# EAGLE design MUS-1099 (EAGLE 9.5.2)
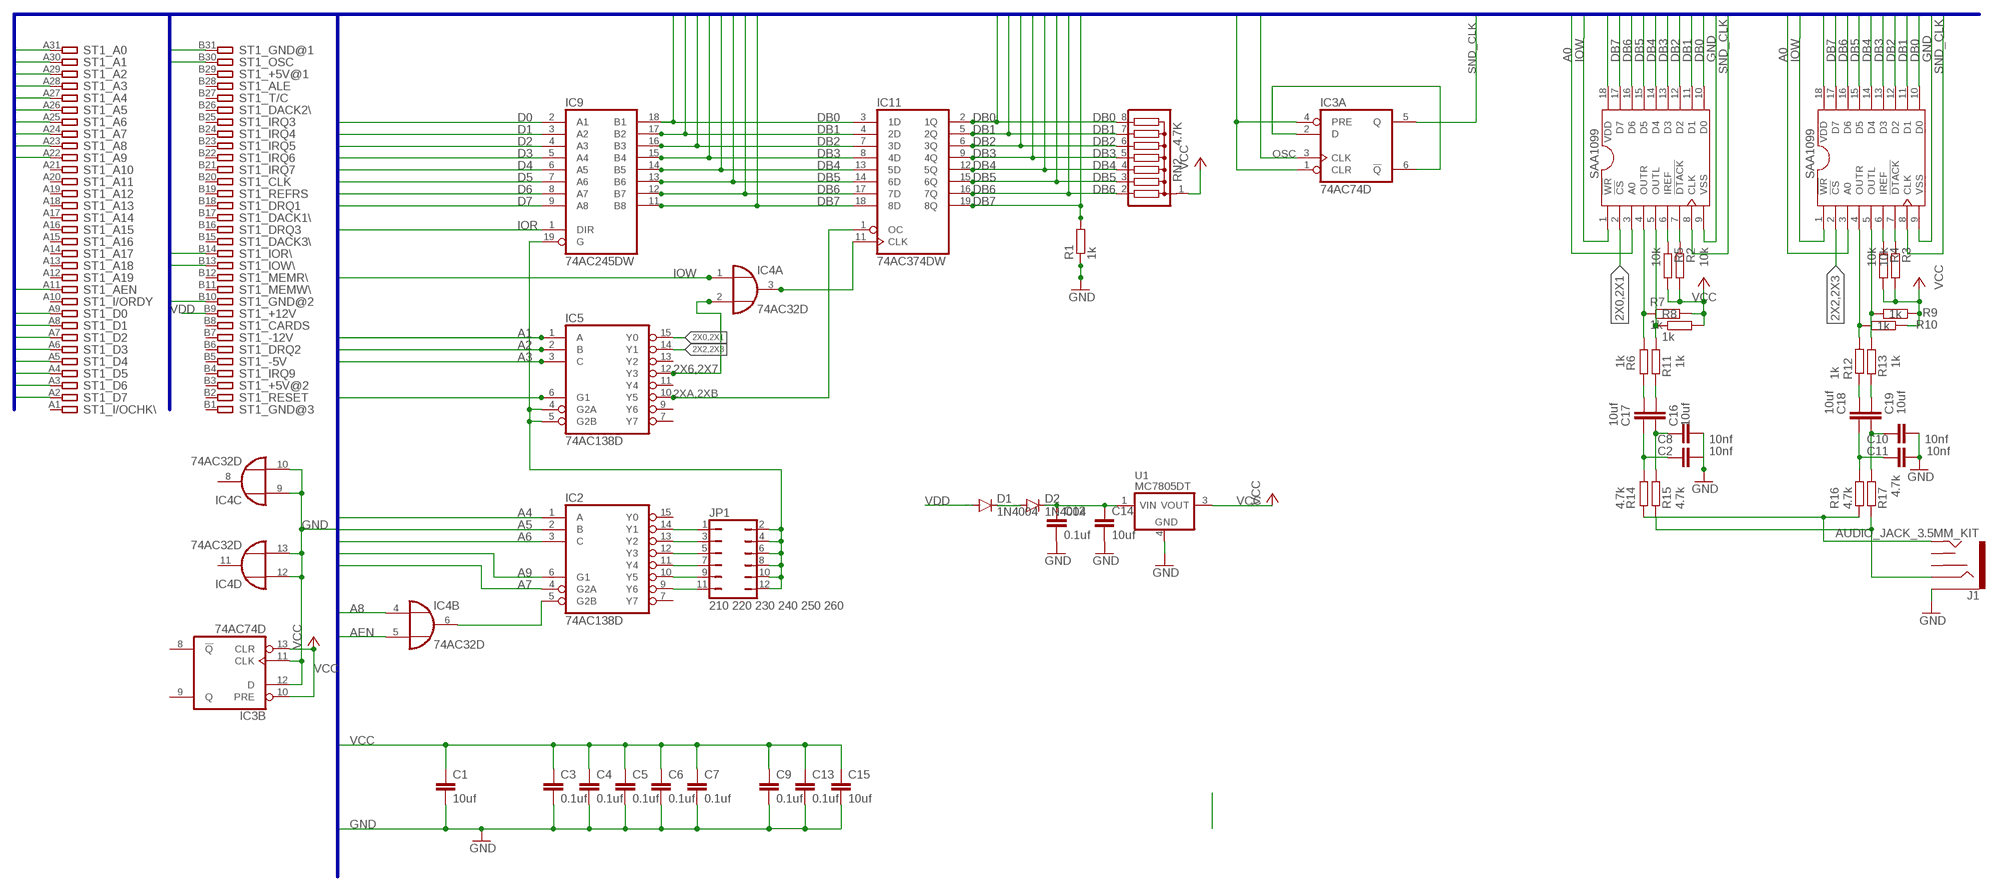
[diagram p0: schematic, sheet 1]

## Parts
C1  10uf  C-EUC0805  [C0805]
C2  10nf  C-EUC0805K  [C0805K]
C3  0.1uf  C-EUC0805  [C0805]
C4  0.1uf  C-EUC0805  [C0805]
C5  0.1uf  C-EUC0805  [C0805]
C6  0.1uf  C-EUC0805  [C0805]
C7  0.1uf  C-EUC0805  [C0805]
C8  10nf  C-EUC0805K  [C0805K]
C9  0.1uf  C-EUC0805  [C0805]
C10  10nf  C-EUC0805K  [C0805K]
C11  10nf  C-EUC0805K  [C0805K]
C12  0.1uf  C-EUC0805  [C0805]
C13  0.1uf  C-EUC0805  [C0805]
C14  10uf  C-EUC0805K  [C0805K]
C15  10uf  C-EUC0805K  [C0805K]
C16  10uf  C-EUC0805K  [C0805K]
C17  10uf  C-EUC0805K  [C0805K]
C18  10uf  C-EUC0805K  [C0805K]
C19  10uf  C-EUC0805K  [C0805K]
D1  1N4004  [DO41-10]
D2  1N4004  [DO41-10]
IC2  74AC138D  [SO16]
IC3  74AC74D  [SO14]
IC4  74AC32D  [SO14]
IC5  74AC138D  [SO16]
IC7  SAA1099  [DIL18]
IC8  SAA1099  [DIL18]
IC9  74AC245DW  [SO20W]
IC11  74AC374DW  [SO20W]
J1  AUDIO_JACK_3.5MM_KIT  [AUDIO-JACK-KIT]
JP1  210 220 230 240 250 260  JP6Q  [JP6Q]
R1  1k  R-EU_R0805  [R0805]
R2  10k  R-EU_R0805  [R0805]
R3  10k  R-EU_R0805  [R0805]
R4  10k  R-EU_R0805  [R0805]
R5  10k  R-EU_R0805  [R0805]
R6  1k  R-EU_R0805  [R0805]
R7  1k  R-EU_R0805  [R0805]
R8  1k  R-EU_R0805  [R0805]
R9  1k  R-EU_R0805  [R0805]
R10  1k  R-EU_R0805  [R0805]
R11  1k  R-EU_R0805  [R0805]
R12  1k  R-EU_R0805  [R0805]
R13  1k  R-EU_R0805  [R0805]
R14  4.7k  R-EU_R0805  [R0805]
R15  4.7k  R-EU_R0805  [R0805]
R16  4.7k  R-EU_R0805  [R0805]
R17  4.7k  R-EU_R0805  [R0805]
RN2  4.7K  G07R  [SIL8]
ST1  8 bit ISA  IBM8BIT  [IBM8BIT]
U1  MC7805DT  [DPAK-3]

## Nets
2X0,2X1: IC5.15(Y0) IC7.2(!CS!)
2X2,2X3: IC5.14(Y1) IC8.2(!CS!)
2X6,2X7: IC4.2(A:I1) IC5.12(Y3)
2XA,2XB: IC5.10(Y5) IC11.1(OC)
A0: IC7.3(A0) IC8.3(A0) ST1.A31
A1: IC5.1(A) ST1.A30
A2: IC5.2(B) ST1.A29
A3: IC5.3(C) ST1.A28
A4: IC2.1(A) ST1.A27
A5: IC2.2(B) ST1.A26
A6: IC2.3(C) ST1.A25
A7: IC2.4(G2A) ST1.A24
A8: IC4.4(B:I0) ST1.A23
A9: IC2.6(G1) ST1.A22
AEN: IC4.5(B:I1) ST1.A11
D0: IC9.2(A1) ST1.A9
D1: IC9.3(A2) ST1.A8
D2: IC9.4(A3) ST1.A7
D3: IC9.5(A4) ST1.A6
D4: IC9.6(A5) ST1.A5
D5: IC9.7(A6) ST1.A4
D6: IC9.8(A7) ST1.A3
D7: IC9.9(A8) ST1.A2
DB0: IC7.10(D0) IC8.10(D0) IC9.18(B1) IC11.2(1Q) IC11.3(1D) RN2.8
DB1: IC7.11(D1) IC8.11(D1) IC9.17(B2) IC11.4(2D) IC11.5(2Q) RN2.7
DB2: IC7.12(D2) IC8.12(D2) IC9.16(B3) IC11.6(3Q) IC11.7(3D) RN2.6
DB3: IC7.13(D3) IC8.13(D3) IC9.15(B4) IC11.8(4D) IC11.9(4Q) RN2.5
DB4: IC7.14(D4) IC8.14(D4) IC9.14(B5) IC11.12(5Q) IC11.13(5D) RN2.4
DB5: IC7.15(D5) IC8.15(D5) IC9.13(B6) IC11.14(6D) IC11.15(6Q) RN2.3
DB6: IC7.16(D6) IC8.16(D6) IC9.12(B7) IC11.16(7Q) IC11.17(7D) RN2.2
DB7: IC7.17(D7) IC8.17(D7) IC9.11(B8) IC11.18(8D) IC11.19(8Q) R1.2
GND: C1.2 C2.2 C3.2 C4.2 C5.2 C6.2 C7.2 C8.2 C9.2 C10.2 C11.2 C12.2 C13.2 C14.2 C15.2 IC3.11(B:CLK) IC3.12(B:D) IC4.9(C:I0) IC4.10(C:I1) IC4.12(D:I0) IC4.13(D:I1) IC7.9(VSS) IC8.9(VSS) J1.SLEEVE R1.1 ST1.B10 ST1.B31 U1.4(GND)
IOR: IC9.1(DIR) ST1.B14
IOW: IC4.1(A:I0) IC7.1(!WR!) IC8.1(!WR!) ST1.B13
N210: IC2.14(Y1) JP1.1
N220: IC2.13(Y2) JP1.3
N230: IC2.12(Y3) JP1.5
N240: IC2.11(Y4) JP1.7
N250: IC2.10(Y5) JP1.9
N260: IC2.9(Y6) JP1.11
N$1: IC2.5(G2B) IC4.6(B:O)
N$3: IC7.6(IREF) R5.1
N$4: IC7.7(!DTACK!) R2.1
N$5: IC8.7(!DTACK!) R3.1
N$6: IC8.6(IREF) R4.1
N$7: IC7.4(OUTR) R6.1 R7.1
N$8: IC5.4(G2A) IC5.5(G2B) IC9.19(G) JP1.2 JP1.4 JP1.6 JP1.8 JP1.10 JP1.12
N$9: IC7.5(OUTL) R8.1 R11.1
N$10: IC4.3(A:O) IC11.11(CLK)
N$11: IC3.2(A:D) IC3.6(A:!Q)
N$12: IC8.4(OUTR) R10.2 R12.2
N$13: IC8.5(OUTL) R9.2 R13.1
N$14: C2.1 C17.2 R14.1
N$15: C8.1 C16.2 R15.1
N$16: C11.1 C18.2 R16.1
N$17: C10.1 C19.2 R17.1
N$18: J1.RING R15.2 R17.2
N$19: J1.TIP R14.2 R16.2
N$20: D1.C D2.A
N$21: C12.1 C14.1 D2.C U1.1(VIN)
N$22: C17.1 R6.2
N$23: C16.1 R11.2
N$24: C18.1 R12.1
N$25: C19.1 R13.2
OSC: IC3.3(A:CLK) ST1.B30
SND_CLK: IC3.5(A:Q) IC7.8(CLK) IC8.8(CLK)
VCC: C1.1 C3.1 C4.1 C5.1 C6.1 C7.1 C9.1 C13.1 C15.1 IC3.1(A:CLR) IC3.4(A:PRE) IC3.10(B:PRE) IC3.13(B:CLR) IC5.6(G1) IC7.18(VDD) IC8.18(VDD) R2.2 R3.2 R4.2 R5.2 R7.2 R8.2 R9.1 R10.1 RN2.1 U1.3(VOUT)
VDD: D1.A ST1.B9
Unconnected: IC2.7(Y7) IC2.15(Y0) IC3.8(B:!Q) IC3.9(B:Q) IC4.8(C:O) IC4.11(D:O) IC5.7(Y7) IC5.9(Y6) IC5.11(Y4) IC5.13(Y2) J1.RSH J1.TSH ST1.A1 ST1.A10 ST1.A12 ST1.A13 ST1.A14 ST1.A15 ST1.A16 ST1.A17 ST1.A18 ST1.A19 ST1.A20 ST1.A21 ST1.B1 ST1.B2 ST1.B3 ST1.B4 ST1.B5 ST1.B6 ST1.B7 ST1.B8 ST1.B11 ST1.B12 ST1.B15 ST1.B16 ST1.B17 ST1.B18 ST1.B19 ST1.B20 ST1.B21 ST1.B22 ST1.B23 ST1.B24 ST1.B25 ST1.B26 ST1.B27 ST1.B28 ST1.B29

## Buses
A[0..9],AEN,D[0..7],DB[0..7],GND,IOR,IOW,OSC,SND_CLK,VCC

## Power pins joined to a net without a drawn wire
GND: IC2.8(GND) IC3.7(P:GND) IC4.7(P:GND) IC5.8(GND) IC9.10(GND) IC11.10(GND)
VCC: IC2.16(VCC) IC3.14(P:VCC) IC4.14(P:VCC) IC5.16(VCC) IC9.20(VCC) IC11.20(VCC)

## Library data of the parts
C1-C19 = rcl:C-EU: CAPACITOR, European symbol; SPICEPREFIX: C
D1 D2 = diode:1N4004: DIODE general purpose rectifier, 1 A
IC2 IC5 = 74xx-eu:74*138: 3-line to 8-line DECODER/DEMULTIPLEXER
IC3 = 74xx-eu:74*74: Dual D type positive edge triggered FLIP FLOP, preset and clear
IC4 = 74xx-eu:74*32: Quad 2-input OR gate
IC7 IC8 = William-Custom:SAA1099
IC9 = 74xx-eu:74*245: Octal BUS TRANSCEIVER, 3-state
IC11 = 74xx-eu:74*374: Octal D type transparent LATCH, edge triggered
J1 = SparkFun-Connectors:AUDIO_JACK_3.5MM: Audio Jack 3.5mm variants of PTH and SMT stereo audio jack with bypass switches. SparkFun Products: SparkFun SparkPunk Sound Kit <[https://www.sparkfun.com/products/11177]> - PTH MP3 Trigger <https://www.sparkfun.com/products/13720> -3.5mm SMD SparkFun PicoBoard <https://www.sparkfun.com/products/11888>- 2.5mm SMD; PROD_ID: CONN-08774; SF_ID: PRT-08032
JP1 = William-Custom:JP6Q: JUMPER
R1-R17 = rcl:R-EU_: RESISTOR, European symbol; SPICEPREFIX: R
RN2 = resistor-sil:G07R: SIL RESISTOR; OC_FARNELL: unknown; OC_NEWARK: unknown
ST1 = William-Custom:IBM8BIT: 8-bit CARD IBM/PC-AT
U1 = _hhn_78xx_79xx_NCV78xx_d2pak_dpak:MC78*: 78xx SMD (D2PAK, DPAK) (MC)78xx..DT (DPAK-3; Rth,JA = 92 K/W) (MC)78xx..D2T (D2PAK-3; Rth,JA = 45 K/W @ 10x10mm copper area) Linear Voltage Regulators, Positive, 1 A (ON Semiconductor) Package dimenisions and soldering footprints acc. to ONSEMI specs. Source: http://onsemi.com Datasheet document#: MC7800/D Technologies: 78xxyD(2)Tz: xx = Output Voltage (V) y, z: additional suffixes see manufacturer's datasheet Author: Dipl.-Ing. FH Rainer Bayer HHN Hochschule Heilbronn, rainer.bayer@hs-heilbronn.de Ingenieurbüro ing-rb, mail@ing-rb.de

## Board
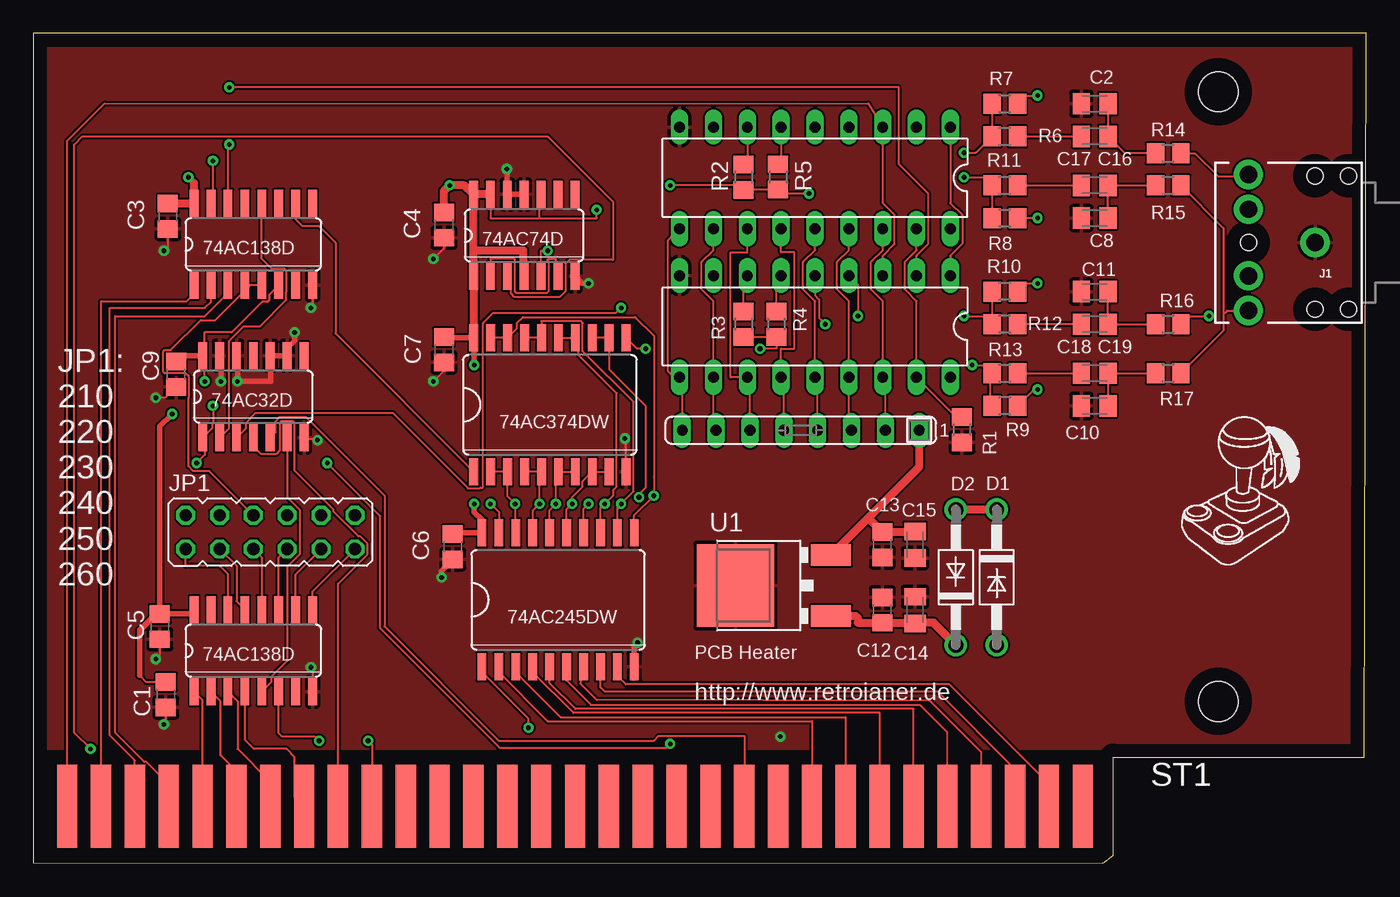
[diagram p1: board, top side]
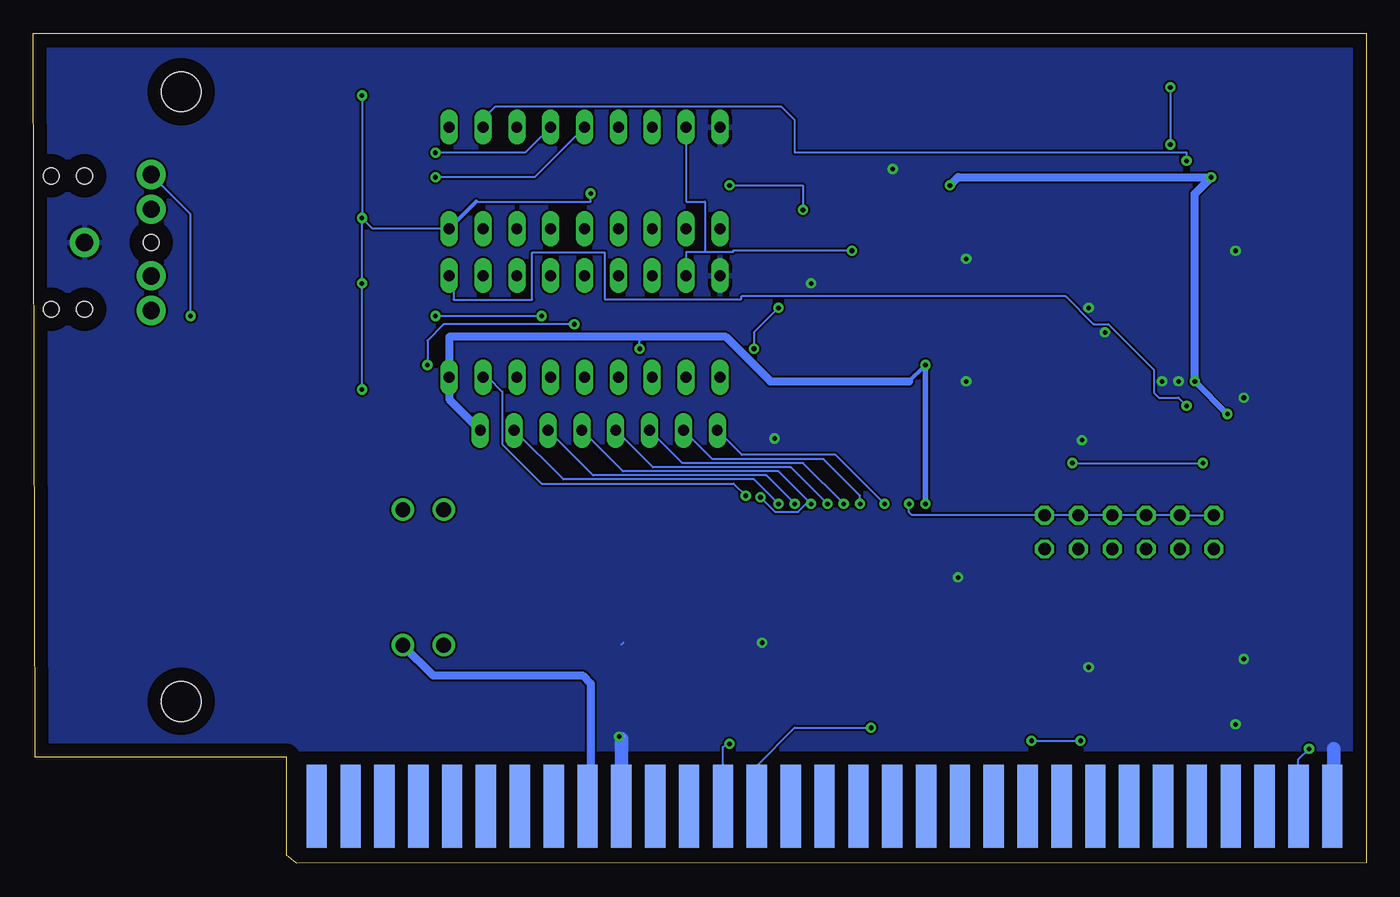
[diagram p2: board, bottom side, seen from below]

Size 100 x 62.24 mm. Coordinates in mm from the lower left corner, seen from the top.
Outline: 0,0.05 80.24,0 81.01,0.61 81.01,7.96 99.84,7.96 100,62.24 0,62.24 0,0.05
Copper layers (1*16): Top 0.035mm / dielectric 1.5mm / Bottom 0.035mm
Design rules "default": minimum track width 6mil, minimum drill 0.35mm, track to track 6mil, track to pad 6mil, pad to pad 6mil, via to via 6mil, smd to smd 6mil, copper to edge 40mil, drill to drill 6mil, minimum pad ring 10mil, minimum via ring 8mil, stop-mask expansion 4mil, vias tented up to drill 0mil, thermal gap 10mil
Holes 3 mm at 88.9,57.85 88.9,12.13

### Footprints (pad centres in the part's own frame; a part is rotated, then mirrored left to right if it is on the bottom)
C0805 = smd 1.3 x 1.5: 1 -0.95,0; 2 0.95,0
C0805K = smd 1.3 x 1.6: 1 -1,0; 2 1,0
DO41-10 = drill 1.118: A 5.08,0; C -5.08,0
SO16 = smd 0.66 x 2.032: 1 -4.445,-3.073; 2 -3.175,-3.073; 3 -1.905,-3.073; 4 -0.635,-3.073; 5 0.635,-3.073; 6 1.905,-3.073; 7 3.175,-3.073; 8 4.445,-3.073; 9 4.445,3.073; 10 3.175,3.073; 11 1.905,3.073; 12 0.635,3.073; 13 -0.635,3.073; 14 -1.905,3.073; 15 -3.175,3.073; 16 -4.445,3.073
SO14 = smd 0.66 x 2.032: 1 -3.81,-3.073; 2 -2.54,-3.073; 3 -1.27,-3.073; 4 0,-3.073; 5 1.27,-3.073; 6 2.54,-3.073; 7 3.81,-3.073; 8 3.81,3.073; 9 2.54,3.073; 10 1.27,3.073; 11 0,3.073; 12 -1.27,3.073; 13 -2.54,3.073; 14 -3.81,3.073
DIL18 = drill 0.813 long: 1 -10.16,-3.81; 2 -7.62,-3.81; 3 -5.08,-3.81; 4 -2.54,-3.81; 5 0,-3.81; 6 2.54,-3.81; 7 5.08,-3.81; 8 7.62,-3.81; 9 10.16,-3.81; 10 10.16,3.81; 11 7.62,3.81; 12 5.08,3.81; 13 2.54,3.81; 14 0,3.81; 15 -2.54,3.81; 16 -5.08,3.81; 17 -7.62,3.81; 18 -10.16,3.81
SO20W = smd 0.66 x 2.032: 1 -5.715,-5.029; 2 -4.445,-5.029; 3 -3.175,-5.029; 4 -1.905,-5.029; 5 -0.635,-5.029; 6 0.635,-5.029; 7 1.905,-5.029; 8 3.175,-5.029; 9 4.445,-5.029; 10 5.715,-5.029; 11 5.715,5.029; 12 4.445,5.029; 13 3.175,5.029; 14 1.905,5.029; 15 0.635,5.029; 16 -0.635,5.029; 17 -1.905,5.029; 18 -3.175,5.029; 19 -4.445,5.029; 20 -5.715,5.029
AUDIO-JACK-KIT = drill 1.3 pad 2.184: RING 5,5.1; RSH 5,2.5; SLEEVE 0,0; TIP 5,-5.1; TSH 5,-2.5 | hole 1.2: 0,5; -2.5,5; -2.5,-5; 0,-5; 5,0
JP6Q = drill 0.914 octagon: 1 -6.35,-1.27; 2 -6.35,1.27; 3 -3.81,-1.27; 4 -3.81,1.27; 5 -1.27,-1.27; 6 -1.27,1.27; 7 1.27,-1.27; 8 1.27,1.27; 9 3.81,-1.27; 10 3.81,1.27; 11 6.35,-1.27; 12 6.35,1.27
R0805 = smd 1.3 x 1.5: 1 -0.95,0; 2 0.95,0
SIL8 = drill 0.813 long: 1 -8.89,0; 2 -6.35,0; 3 -3.81,0; 4 -1.27,0; 5 1.27,0; 6 3.81,0; 7 6.35,0; 8 8.89,0
IBM8BIT = smd 1.524 x 6.223: A1 -25.4,4.826; A2 -27.94,4.826; A3 -30.48,4.826; A4 -33.02,4.826; A5 -35.56,4.826; A6 -38.1,4.826; A7 -40.64,4.826; A8 -43.18,4.826; A9 -45.72,4.826; A10 -48.26,4.826; A11 -50.8,4.826; A12 -53.34,4.826; A13 -55.88,4.826; A14 -58.42,4.826; A15 -60.96,4.826; A16 -63.5,4.826; A17 -66.04,4.826; A18 -68.58,4.826; A19 -71.12,4.826; A20 -73.66,4.826; A21 -76.2,4.826; A22 -78.74,4.826; A23 -81.28,4.826; A24 -83.82,4.826; A25 -86.36,4.826; A26 -88.9,4.826; A27 -91.44,4.826; A28 -93.98,4.826; A29 -96.52,4.826; A30 -99.06,4.826; A31 -101.6,4.826 | smd 1.524 x 6.223 bottom: B1 -25.4,4.826; B2 -27.94,4.826; B3 -30.48,4.826; B4 -33.02,4.826; B5 -35.56,4.826; B6 -38.1,4.826; B7 -40.64,4.826; B8 -43.18,4.826; B9 -45.72,4.826; B10 -48.26,4.826; B11 -50.8,4.826; B12 -53.34,4.826; B13 -55.88,4.826; B14 -58.42,4.826; B15 -60.96,4.826; B16 -63.5,4.826; B17 -66.04,4.826; B18 -68.58,4.826; B19 -71.12,4.826; B20 -73.66,4.826; B21 -76.2,4.826; B22 -78.74,4.826; B23 -81.28,4.826; B24 -83.82,4.826; B25 -86.36,4.826; B26 -88.9,4.826; B27 -91.44,4.826; B28 -93.98,4.826; B29 -96.52,4.826; B30 -99.06,4.826; B31 -101.6,4.826
DPAK-3 = smd 1.6 x 3: 1 -2.286,-7.18; 3 2.286,-7.18 | smd 6.2 x 5.8: 4 0,0

### Placement (x,y rotation side)
C1  9.94,12.63 270 top
C2  79.62,56.96 180 top
C3  10.1,48.52 270 top
C4  30.82,47.86 270 top
C5  9.48,17.75 270 top
C6  31.47,23.74 270 top
C7  30.82,38.51 270 top
C8  79.62,48.39 180 top
C9  10.71,36.67 270 top
C10  79.62,34.3 180 top
C11  79.62,42.88 180 top
C12  63.7,18.99 90 top
C13  63.7,23.89 270 top
C14  66.15,18.99 90 top
C15  66.15,23.89 270 top
C16  79.62,50.84 0 top
C17  79.62,54.51 0 top
C18  79.62,40.43 0 top
C19  79.62,36.75 0 top
D1  72.28,21.44 270 top
D2  69.21,21.44 90 top
IC2  16.51,15.94 0 top
IC3  36.83,47.08 0 top
IC4  16.51,34.99 0 top
IC5  16.51,46.42 0 top
IC7  58.65,51.4 180 top
IC8  58.65,40.25 180 top
IC9  39.37,19.75 0 top
IC11  38.76,34.38 0 top
J1  96.16,46.55 180 top
JP1  17.78,24.83 0 top
R1  69.69,32.51 90 top
R2  53.29,51.45 270 top
R3  53.29,40.43 270 top
R4  55.74,40.43 270 top
R5  55.88,51.48 270 top
R6  72.89,54.51 0 top
R7  72.89,56.96 0 top
R8  72.89,48.39 0 top
R9  72.89,34.3 180 top
R10  72.89,42.88 180 top
R11  72.89,50.84 0 top
R12  72.89,40.43 180 top
R13  72.89,36.75 0 top
R14  85.14,53.24 0 top
R15  85.14,50.84 0 top
R16  85.14,40.43 0 top
R17  85.14,36.75 0 top
RN2  57.58,32.46 180 top
ST1  104.14,-0.57 0 top
U1  52.67,20.83 90 top

### Tracks (layer width: path | path; a pad name or v marks a point on that pad's centre or on a via)
2X0,2X1  (via drill 0.35)
  Top 0.152: IC5.15 13.47,49.64 v13.47,52.68
  Bottom 0.152: IC7.2 66.27,55.82 65.33,56.75 43.89,56.75 42.88,55.74 42.88,53.29 13.47,53.29 v13.47,52.68
2X2,2X3  (via drill 0.35)
  Top 0.152: IC5.14 14.61,53.8 v14.7,53.9 | IC8.2 66.27,45.55 67.15,46.44 67.15,50.2 64.93,52.42 64.93,58.19 v14.7,58.19
  Bottom 0.152: v14.7,58.19 v14.7,53.9
2X6,2X7
  Top 0.152: IC4.2 14.68,32.63 14.68,39.18 15.77,40.27 17,40.27 18.97,42.24 18.97,42.86 18.99,42.87 18.99,44.45 18.84,44.59 17.88,44.59 17.14,45.33 IC5.12
2XA,2XB
  Top 0.152: IC5.10 19.68,50.14 19.6,50.22 19.6,48.39 20.21,47.77 21.44,47.77 22.66,46.55 22.66,39.73 IC11.1
A0
  Top 0.152: ST1.A31 2.54,54.18 5.32,56.96 62.62,56.99 IC7.3 63.73,49.5 64.61,48.61 64.61,46.44 63.73,45.55 IC8.3
A1
  Top 0.152: ST1.A30 5.08,42.12 11.45,42.12 12.06,42.74 IC5.1
A2
  Top 0.152: ST1.A29 7.62,7.71 5.74,9.59 5.74,41.65 12.86,41.65 13.34,42.12 IC5.2
A3
  Top 0.152: ST1.A28 10.16,5.92 8.48,7.6 8.33,7.6 6.12,9.8 6.12,41.04 12.86,41.04 14.61,42.78 IC5.3
A4
  Top 0.152: ST1.A27 12.7,12.23 IC2.1
A5
  Top 0.152: IC2.2 14.05,12.16 14.05,8.08 15.24,6.89 ST1.A26
A6
  Top 0.152: IC2.3 15.31,12.16 15.31,8.57 17.76,6.13
  Top 0.305: ST1.A25 17.76,4.28 17.76,6.13
A7
  Top 0.152: ST1.A24 19.6,4.98 19.6,7.96 18.99,8.57 16.54,8.57 15.88,9.24 IC2.4
A8
  Top 0.152: ST1.A23 22.86,20.96 25.07,23.17 25.07,23.95 24.52,24.5 24.4,24.5 22.53,26.37 22.53,26.49 19.61,29.41 19.61,33.03 19.48,33.16 18.62,33.16 18.49,33.03 18.49,30.96 18.2,30.67 17.1,30.67 16.51,31.26 IC4.4
A9  (via drill 0.35)
  Top 0.152: IC2.6 18.38,12.83 18.38,9.8 18.68,9.49 21.13,9.49 v21.44,9.19 | v25.11,9.19 25.4,8.9 ST1.A22
  Bottom 0.152: v25.11,9.19 v21.44,9.19
AEN
  Top 0.152: IC4.5 18.19,32.33 18.19,33.16 18.5,33.47 20.44,33.47 26.34,27.57 26.34,17.76 34.91,9.19 46.55,9.19 46.92,9.55 53.34,9.55 ST1.A11
D0
  Top 0.152: IC9.2 34.92,14.32 38.59,10.66 58.42,10.66 ST1.A9
D1
  Top 0.152: IC9.3 36.2,14.32 39.56,10.96 60.96,10.96 60.96,4.51
  Top 0.305: ST1.A8 60.96,4.51
D2
  Top 0.152: ST1.A7 63.5,11.27 40.52,11.27 37.47,14.32 IC9.4
D3
  Top 0.152: ST1.A6 66.04,11.57 40.66,11.57 38.73,13.5 IC9.5
D4
  Top 0.152: IC9.6 40.01,13.71 41.84,11.88 66.52,11.88 68.58,9.82 ST1.A5
D5
  Top 0.152: ST1.A4 71.12,8.32 67.26,12.18 42.26,12.25 41.04,13.47 41.04,14.09 41.27,14.33 IC9.7
D6
  Top 0.152: ST1.A3 73.66,7.05 67.85,12.86 42.88,12.86 42.55,13.19 IC9.8
D7
  Top 0.152: ST1.A2 75.88,4.58 75.88,6.24 68.71,13.4 44.45,13.4 43.81,14.04 IC9.9
DB0  (via drill 0.35)
  Top 0.152: IC9.18 36.2,26.89 v36.14,26.95 35.58,27.51 IC11.3 35.53,29.4 34.36,29.4 IC11.2 | IC7.10 47.6,46.7 47.6,36.93 48.08,36.44 IC8.10 48.69,36.24 RN2.8
  Bottom 0.152: v36.14,26.95 39.81,30.62 46.85,30.62 RN2.8
DB1  (via drill 0.35)
  Top 0.152: IC9.17 37.47,26.44 v37.98,26.95 37.98,29.2 IC11.5 IC11.4 | RN2.7 51.02,32.66 IC8.11 51.02,42.14 50.14,43.03 50.14,45.09 51.02,45.98 IC7.11
  Bottom 0.152: v37.98,26.95 37.98,27.56 40.71,30.3 49.05,30.3 51.22,32.46 RN2.7
DB2  (via drill 0.35)
  Top 0.152: IC9.16 38.73,26.49 v39.2,26.95 39.2,29.16 IC11.6 IC11.7 | RN2.6 53.77,36.24 IC8.12 52.31,36.44 52.31,40.27 52.31,40.43 52.31,45.82 53.56,45.82 IC7.12
  Bottom 0.152: v39.2,26.95 42.25,30 51.29,30 53.76,32.46 RN2.6
DB3  (via drill 0.35)
  Top 0.152: IC9.15 40.01,26.53 v40.42,26.95 40.42,27.44 41.22,28.24 41.22,28.64 IC11.8 IC11.9 | RN2.5 56.3,36.24 IC8.13 56.1,38.6 57.1,38.6 57.1,45.82 56.1,45.82 IC7.13
  Bottom 0.152: v40.42,26.95 43.17,29.69 53.52,29.69 RN2.5
DB4  (via drill 0.35)
  Top 0.152: IC9.14 41.27,26.58 v41.65,26.95 | IC11.13 IC11.12 43.2,37.04 45.94,34.3 45.94,28.17 45.33,27.56 v45.45,27.44 | RN2.4 58.84,36.24 IC8.14 58.65,42.14 57.76,43.03 57.76,45.09 58.65,45.98 IC7.14
  Bottom 0.152: RN2.4 58.84,32.46 55.76,29.39 44.09,29.39 v41.65,26.95 42.02,26.95 42.62,26.34 44.35,26.34 v45.45,27.44
DB5  (via drill 0.35)
  Top 0.152: IC9.13 42.55,26.62 v42.88,26.95 43.49,27.56 43.49,27.97 43.76,28.24 43.76,35.25 40.92,38.1 40.92,38.59 40.42,38.59 40.42,39.41 IC11.14 IC11.15 | IC7.15 61.19,45.98 60.3,45.09 60.3,43.03 61.19,42.14 IC8.15 61.19,32.66 RN2.3
  Bottom 0.152: v42.88,26.95 45.01,29.08 57.99,29.08 61.38,32.46 RN2.3
DB6  (via drill 0.35)
  Top 0.152: IC9.12 43.81,26.67 v44.1,26.95 45.03,27.88 45.03,34.59 41.22,38.4 41.22,40.52 41.09,40.65 38.12,40.65 IC11.16 IC11.17 | IC8.16 63.73,36.75 | 63.73,36.75 63.73,42.14 62.84,43.03 62.84,45.09 63.73,45.98 IC7.16 | RN2.2 63.92,36.55 63.73,36.75
  Bottom 0.152: v44.1,26.95 45.93,28.78 60.23,28.78 63.91,32.46 RN2.2
DB7  (via drill 0.35)
  Top 0.152: IC9.11 45.09,26.1 v46.55,27.56 46.55,28.97 46.56,28.98 46.56,39.56 45.16,40.96 36.73,40.96 36.29,40.52 36.29,40.12 IC11.18 IC11.19 | IC7.17 66.27,45.98 65.38,45.09 65.38,43.03 66.27,42.14 IC8.17 69.25,33.46 R1.2
  Bottom 0.152: v46.55,27.56 47.46,28.47 61.85,28.47 64.81,31.43 64.81,35.36 65.9,36.44 IC8.17
GND  (via drill 0.35)
  Top 0.152: C5.2 9.48,15.61 v9.19,15.31 | v20.82,14.7 20.95,14.57 IC2.8 | IC11.10 44.47,31.76 v44.38,31.85 | IC4.7 20.39,31.85 21.2,31.85 v21.32,31.73 | C3.2 10.1,46.23 v9.8,45.94 | IC5.8 20.95,41.78 v20.82,41.65 | C9.2 9.9,34.91 v9.19,34.91 | C1.2 9.94,10.55 v9.8,10.41 | C7.2 30.82,36.94 v30.01,36.14 | C4.2 30.82,46.13 v30.01,45.33
  Top 0.406: C6.2 30.62,21.94 v30.62,21.44 | IC9.10 45.09,16.3 v45.33,16.54 | v19.6,39.81 19.6,39.2 19.05,38.65 IC4.9 IC4.10 17.81,38.04 17.81,36.14 v15.31,36.14 15.31,37.99 IC4.12 | IC4.13 14.09,37.95 14.09,36.14 v14.07,36.14 | IC3.7 41.16,43.49 v41.65,43.49 | IC3.11 IC3.12 35.52,50.19 v35.52,52.06
  Bottom 0.152: 55.88,16.4 55.74,16.54 | 55.88,9.33 v56.04,9.49
  Bottom 0.406: 2.54,7.35 ST1.B31
  Bottom 0.508: 2.45,8.57 2.54,8.57 2.54,7.35 2.45,7.35
  Bottom 1.016: ST1.B10 55.88,9.33 | 2.45,8.57 2.45,7.35
  pour Bottom: -0.61,60.64 -0.61,8.57 99.84,8.57 99.84,61.25 0,61.25
  pour Top: 0,61.25 0,8.57 100.5,8.57 100.5,61.25
IOR  (via drill 0.35)
  Top 0.152: v37.15,10.16 37.15,10.83 33.75,14.23 33.75,14.62 IC9.1
  Bottom 0.152: ST1.B14 45.72,7.32 42.88,10.16 v37.15,10.16
IOW  (via drill 0.35)
  Top 0.152: v47.77,8.95 47.47,8.64 35.03,8.64 26.03,17.64 26.03,26.03 v22.05,30.01 | v12.25,30.01 12.86,30.62 12.86,31.76 IC4.1 13.41,32.63 13.41,33.03 13.47,33.09 v13.47,34.3 | IC8.1 68.81,45.55 69.69,46.44 69.69,48.61 68.81,49.5 IC7.1
  Bottom 0.152: ST1.B13 48.26,8.7 47.77,9.19 v47.77,8.95 | v22.05,30.01 v12.25,30.01 | IC8.1 68.8,44.06 68.47,43.74 68.47,42.26 62.57,42.26 62.57,45.82 57.13,45.82 57.13,42.31 46.88,42.31 46.88,42.51 22.55,42.51 20.45,40.42 19.35,40.42 15.92,36.99 15.92,35.27 15.56,34.92 14.09,34.92 v13.47,34.3
N210
  Top 0.152: IC2.14 14.61,21.66 13.97,22.29 11.43,22.29 JP1.1
N220
  Top 0.152: JP1.3 15.24,22.29 15.24,19.65 IC2.13
N230
  Top 0.152: JP1.5 17.14,22.93 IC2.12
N240
  Top 0.152: IC2.11 18.41,22.93 JP1.7
N250
  Top 0.152: IC2.10 19.68,21.66 JP1.9
N260
  Top 0.152: IC2.9 20.95,20.39 JP1.11
N$1
  Top 0.152: IC2.5 17.86,13.58 17.86,13.98 19.05,15.17 19.05,22.23 19.99,23.17 19.99,26.49 19.05,27.43 IC4.6
N$3
  Top 0.152: IC7.6 56.1,52.43 R5.1
N$4
  Top 0.152: IC7.7 53.56,52.4 R2.1
N$5
  Top 0.152: R3.1 53.29,44.06 IC8.7
N$6
  Top 0.152: R4.1 55.74,44.06 IC8.6
N$7  (via drill 0.35)
  Top 0.152: v69.83,53.29 70.71,53.29 R6.1 R7.1
  Bottom 0.152: IC7.4 63.1,53.29 v69.83,53.29
N$8  (via drill 0.35)
  Top 0.152: IC5.5 16.27,43.35 | 16.27,43.35 IC5.4 | JP1.6 13.21,29.41 12,29.41 11.64,29.76 11.64,34.93 11.69,34.98 11.69,35.52 11.69,36.46 11.41,36.74 9.87,36.74 9.73,36.88 9.73,38.36 9.87,38.5 10.32,38.5 12.56,40.73 13.66,40.73 16.27,43.35 | v34.3,26.95 34.92,26.33 IC9.19
  Bottom 0.152: JP1.2 JP1.4 JP1.6 JP1.8 JP1.10 JP1.12 34.06,26.1 34.3,26.34 v34.3,26.95
N$9  (via drill 0.35)
  Top 0.152: v69.83,51.45 71.33,51.45 R11.1 R8.1
  Bottom 0.152: IC7.5 62.4,51.45 v69.83,51.45
N$10  (via drill 0.35)
  Top 0.152: IC4.3 15.95,32.63 15.95,33.03 16.7,33.77 26.95,33.77 32.62,28.11 33.47,28.11 33.54,28.17 33.69,28.17 33.75,28.24 33.75,40.52 34.5,41.26 43.71,41.26 v44.1,41.65 | v45.94,38.59 45.29,38.59 IC11.11
  Bottom 0.152: v44.1,41.65 45.94,39.81 v45.94,38.59
N$11
  Top 0.152: IC3.6 39.2,44.18 39.2,45.33 38.59,45.33 38.59,45.19 38.66,45.12 38.66,44.1 38.66,42.9 38.52,42.76 36.25,42.76 36.14,42.87 36.14,44.1 36.14,45.33 34.3,45.33 34.29,45.32 IC3.2
N$12  (via drill 0.35)
  Top 0.152: IC8.4 61.86,43.38 v61.86,41.04 | v69.83,41.04 71.33,41.04 R12.2 R10.2
  Bottom 0.152: v61.86,41.04 v69.83,41.04
N$13  (via drill 0.35)
  Top 0.152: IC8.5 58.65,42.58 58.95,42.27 58.95,40.89 v59.41,40.43 | v70.44,37.36 71.33,37.36 71.8,36.89 | 71.8,36.89 R13.1 | R9.2 71.8,34.44 71.8,36.89
  Bottom 0.152: v59.41,40.43 69.21,40.43 70.44,39.2 v70.44,37.36
N$14
  Top 0.152: C2.1 C17.2 81.89,53.24 R14.1
N$15
  Top 0.152: R15.1 C16.2 C8.1
N$16
  Top 0.152: C11.1 C18.2 R16.1
N$17
  Top 0.152: R17.1 C19.2 C10.1
N$18
  Top 0.152: R17.2 89.29,39.95 89.29,41.18 | 89.29,41.18 89.56,41.45 J1.RING | R15.2 89.29,47.64 89.29,41.18
N$19  (via drill 0.35)
  Top 0.152: R16.2 86.7,41.04 v88.2,41.04 | J1.TIP 91.02,51.5 88.9,51.5 87.16,53.24 R14.2
  Bottom 0.152: v88.2,41.04 88.2,48.69 J1.TIP
N$20
  Top 0.61: D1.C D2.A
N$21
  Top 0.2: 66.2,18.04 C14.1 | 63.75,17.99 C12.1
  Top 0.61: U1.1 61.7,18.54 61.86,18.37 61.86,18.04 C12.1 | D2.C 67.53,18.04 66.2,18.04 | C14.1 63.75,17.99
N$22
  Top 0.152: R6.2 C17.1
N$23
  Top 0.152: R11.2 C16.1
N$24
  Top 0.152: C18.1 R12.1
N$25
  Top 0.152: R13.2 C19.1
OSC  (via drill 0.35)
  Top 0.152: v4.29,8.57 3.06,9.8 3.06,53.9 3.67,54.51 38.59,54.51 43.48,49.62 43.48,45.25 40.22,45.25 39.93,44.96 39.93,42.9 39.49,42.46 36.12,42.46 35.83,42.75 35.83,43.73 IC3.3
  Bottom 0.152: ST1.B30 5.08,7.78 v4.29,8.57
SND_CLK  (via drill 0.35)
  Top 0.152: IC3.5 38.1,45.94 v38.59,45.94
  Bottom 0.152: v38.59,45.94 47.49,45.94 47.49,45.83 49.61,45.83 | IC8.8 51.02,45.83 49.61,45.83 | IC7.8 51.02,49.61 49.61,49.61 49.61,45.83
VCC  (via drill 0.35)
  Top 0.152: IC5.16 12.03,49.47 | 11.16,38.07 C9.1 | 11.74,18.69 IC2.16 | 30.86,39.41 C7.1 | C5.1 9.48,18.99 | v12.86,36.14 12.86,37.9 12.83,37.94 | 12.83,37.94 IC4.14 | IC5.6 17.7,42.64 17.7,42.24 17.57,42.1 17.17,42.1 14.88,39.81 12.86,39.81 12.83,39.78 12.83,37.94 | C1.1 8.46,13.58 7.96,14.09 | v58.19,50.22 55.88,50.22 R5.2 53.29,50.52 R2.2 53.29,50.84 v47.77,50.84 | v42.26,49 42.26,48.39 37.98,48.39 | IC3.13 34.3,48.39 37.98,48.39 | IC3.10 37.98,50.15 37.98,48.39 | R3.2 R4.2 55.74,38.59 v54.51,38.59 | R7.2 74.45,57.58 v75.34,57.58 | v75.34,48.39 R8.2 | R10.1 74.45,43.49 v75.34,43.49 | R9.1 75.06,35.52 v75.34,35.52
  Top 0.2: 62.81,25.73 62.47,25.73 | C15.1 66.1,24.84
  Top 0.305: 36.75,44.09 IC3.4 | IC3.1 33.04,43.98
  Top 0.406: IC4.14 11.16,38.07 | C5.1 11.74,18.69 | 30.86,39.41 IC11.20 33.08,39.38 v33.08,37.36 | v10.41,33.69 9.48,32.76 9.48,18.99 7.96,17.46 7.96,14.09 | C6.1 31.57,24.78 IC9.20 33.66,25.76 33.08,26.34 v33.08,26.95 | 12.06,51.02 v11.64,51.45
  Top 0.61: 12.03,49.47 C3.1 | IC3.13 IC3.14 | 33.02,45.94 IC3.14 | 36.75,44.09 36.75,45.94 33.02,45.94 | 33.04,43.98 IC11.20 | IC3.14 32.34,50.84 v31.24,50.84 30.82,50.41 C4.1 | IC5.16 12.06,51.02 | IC3.1 33.02,45.94 | U1.3 62.47,25.73 66.47,29.72 RN2.1 | 62.81,25.73 C13.1 66.1,24.84
  Bottom 0.152: 66.78,49.61 58.19,49.61 v58.19,50.22 | v47.77,50.84 42.26,50.84 v42.26,49 | v54.51,38.59 54.51,39.47 | v75.34,57.58 v75.34,48.39 | v75.34,48.39 v75.34,43.49 v75.34,35.52 | IC7.18 74.53,47.58 v75.34,48.39
  Bottom 0.305: 34.3,36.14 v33.08,37.36 | IC7.18 66.78,49.61
  Bottom 0.406: v10.41,33.69 v12.86,36.14 | v33.08,26.95 v33.08,37.36
  Bottom 0.61: v12.86,36.14 12.86,50.22 v11.64,51.45 30.62,51.45 v31.24,50.84 | 34.3,36.14 44.71,36.14 48.05,39.47 54.51,39.47 68.81,39.47 IC8.18 68.81,34.8 RN2.1
VDD
  Bottom 0.2: 58.19,4.49 ST1.B9
  Bottom 0.61: D1.A 70,14.09 58.8,14.09 58.19,13.47 58.19,4.49

### Text on the board
tNames: JP1: / 210 / 220 / 230 / 240 / 250 / 260 | PCB Heater | http://www.retroianer.de
tStop: MUS-2020